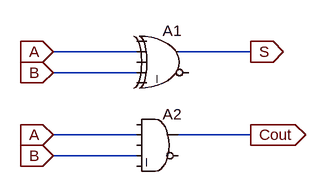
[diagram p0: schematic Half_Adder.asc]
Half_Adder.asc, the LTspice schematic file:
Version 4
SHEET 1 880 680
WIRE 128 80 0 80
WIRE 304 80 192 80
WIRE 128 112 0 112
WIRE 128 208 0 208
WIRE 304 208 192 208
WIRE 128 240 0 240
FLAG 0 80 A
IOPIN 0 80 In
FLAG 0 208 A
IOPIN 0 208 In
FLAG 0 112 B
IOPIN 0 112 In
FLAG 0 240 B
IOPIN 0 240 In
FLAG 304 80 S
IOPIN 304 80 Out
FLAG 304 208 Cout
IOPIN 304 208 Out
SYMBOL Digital\\xor 176 32 R0
SYMATTR InstName A1
SYMBOL Digital\\and 160 160 R0
SYMATTR InstName A2

The netlist it stands for:
* Half_Adder.asc
A1 0 A 0 B 0 0 S 0 XOR
A2 0 A 0 B 0 0 Cout 0 AND
.backanno
.end